# EAGLE design piano_pcb (EAGLE 9.3.1)
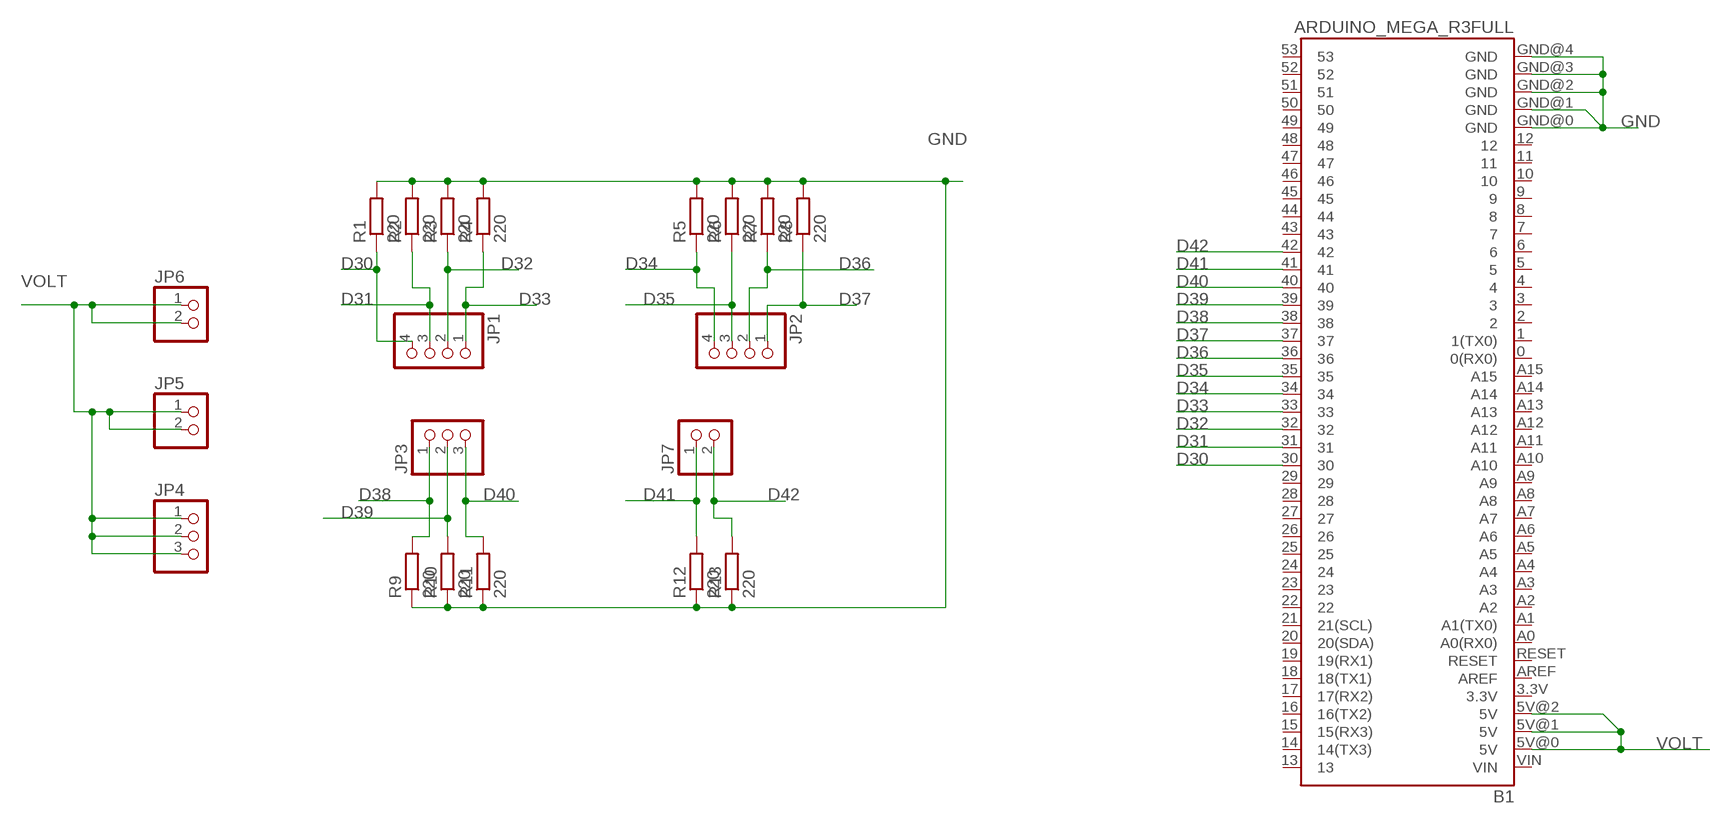
[diagram p0: schematic, sheet 1]

## Parts
B1  ARDUINO_MEGA_R3FULL  [ARDUINO_MEGA]
JP1  PINHD-1X4  [1X04]
JP2  PINHD-1X4  [1X04]
JP3  PINHD-1X3  [1X03]
JP4  PINHD-1X3  [1X03]
JP5  PINHD-1X2  [1X02]
JP6  PINHD-1X2  [1X02]
JP7  PINHD-1X2  [1X02]
R1  220  R-EU_0204/5  [0204/5]
R2  220  R-EU_0204/5  [0204/5]
R3  220  R-EU_0204/5  [0204/5]
R4  220  R-EU_0204/5  [0204/5]
R5  220  R-EU_0204/5  [0204/5]
R6  220  R-EU_0204/5  [0204/5]
R7  220  R-EU_0204/5  [0204/5]
R8  220  R-EU_0204/5  [0204/5]
R9  220  R-EU_0204/5  [0204/5]
R10  220  R-EU_0204/5  [0204/5]
R11  220  R-EU_0204/5  [0204/5]
R12  220  R-EU_0204/5  [0204/5]
R13  220  R-EU_0204/5  [0204/5]

## Nets
D30: B1.30 JP1.4 R1.1
D31: B1.31 JP1.3 R2.1
D32: B1.32 JP1.2 R3.1
D33: B1.33 JP1.1 R4.1
D34: B1.34 JP2.4 R5.1
D35: B1.35 JP2.3 R6.1
D36: B1.36 JP2.2 R7.1
D37: B1.37 JP2.1 R8.1
D38: B1.38 JP3.1 R9.2
D39: B1.39 JP3.2 R10.2
D40: B1.40 JP3.3 R11.2
D41: B1.41 JP7.1 R12.2
D42: B1.42 JP7.2 R13.2
GND: B1.GND@0(GND) B1.GND@1(GND) B1.GND@2(GND) B1.GND@3(GND) B1.GND@4(GND) R1.2 R2.2 R3.2 R4.2 R5.2 R6.2 R7.2 R8.2 R9.1 R10.1 R11.1 R12.1 R13.1
VOLT: B1.5V@0(5V) B1.5V@1(5V) B1.5V@2(5V) JP4.1 JP4.2 JP4.3 JP5.1 JP5.2 JP6.1 JP6.2
Unconnected: B1.0(0(RX0)) B1.1(1(TX0)) B1.2 B1.3 B1.3.3V B1.4 B1.5 B1.6 B1.7 B1.8 B1.9 B1.10 B1.11 B1.12 B1.13 B1.14(14(TX3)) B1.15(15(RX3)) B1.16(16(TX2)) B1.17(17(RX2)) B1.18(18(TX1)) B1.19(19(RX1)) B1.20(20(SDA)) B1.21(21(SCL)) B1.22 B1.23 B1.24 B1.25 B1.26 B1.27 B1.28 B1.29 B1.43 B1.44 B1.45 B1.46 B1.47 B1.48 B1.49 B1.50 B1.51 B1.52 B1.53 B1.A0(A0(RX0)) B1.A1(A1(TX0)) B1.A2 B1.A3 B1.A4 B1.A5 B1.A6 B1.A7 B1.A8 B1.A9 B1.A10 B1.A11 B1.A12 B1.A13 B1.A14 B1.A15 B1.AREF B1.RESET B1.VIN

## Library data of the parts
B1 = SparkFun-Boards:ARDUINO_MEGA_R3: Arduino Mega R3 ATmega2560 R3 compatible footprint. SparkFun Products: Arduino Mega 2560 R3 <https://www.sparkfun.com/products/11061>
JP1 JP2 = pinhead:PINHD-1X4: PIN HEADER
JP3 JP4 = pinhead:PINHD-1X3: PIN HEADER
JP5-JP7 = pinhead:PINHD-1X2: PIN HEADER
R1-R13 = rcl:R-EU_: RESISTOR, European symbol; SPICEPREFIX: R

## Board
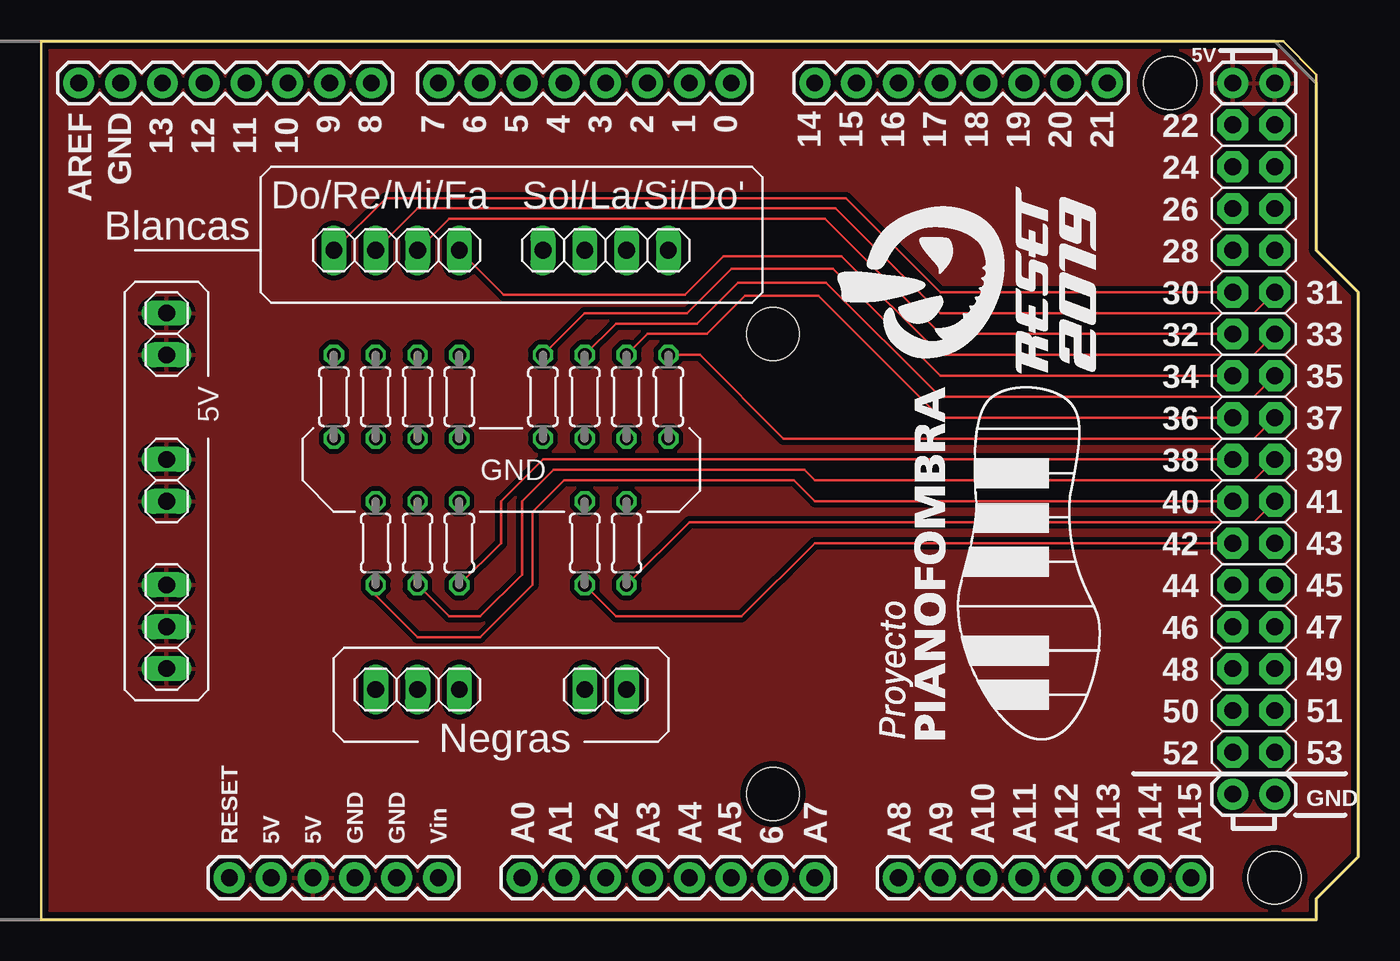
[diagram p1: board, top side]
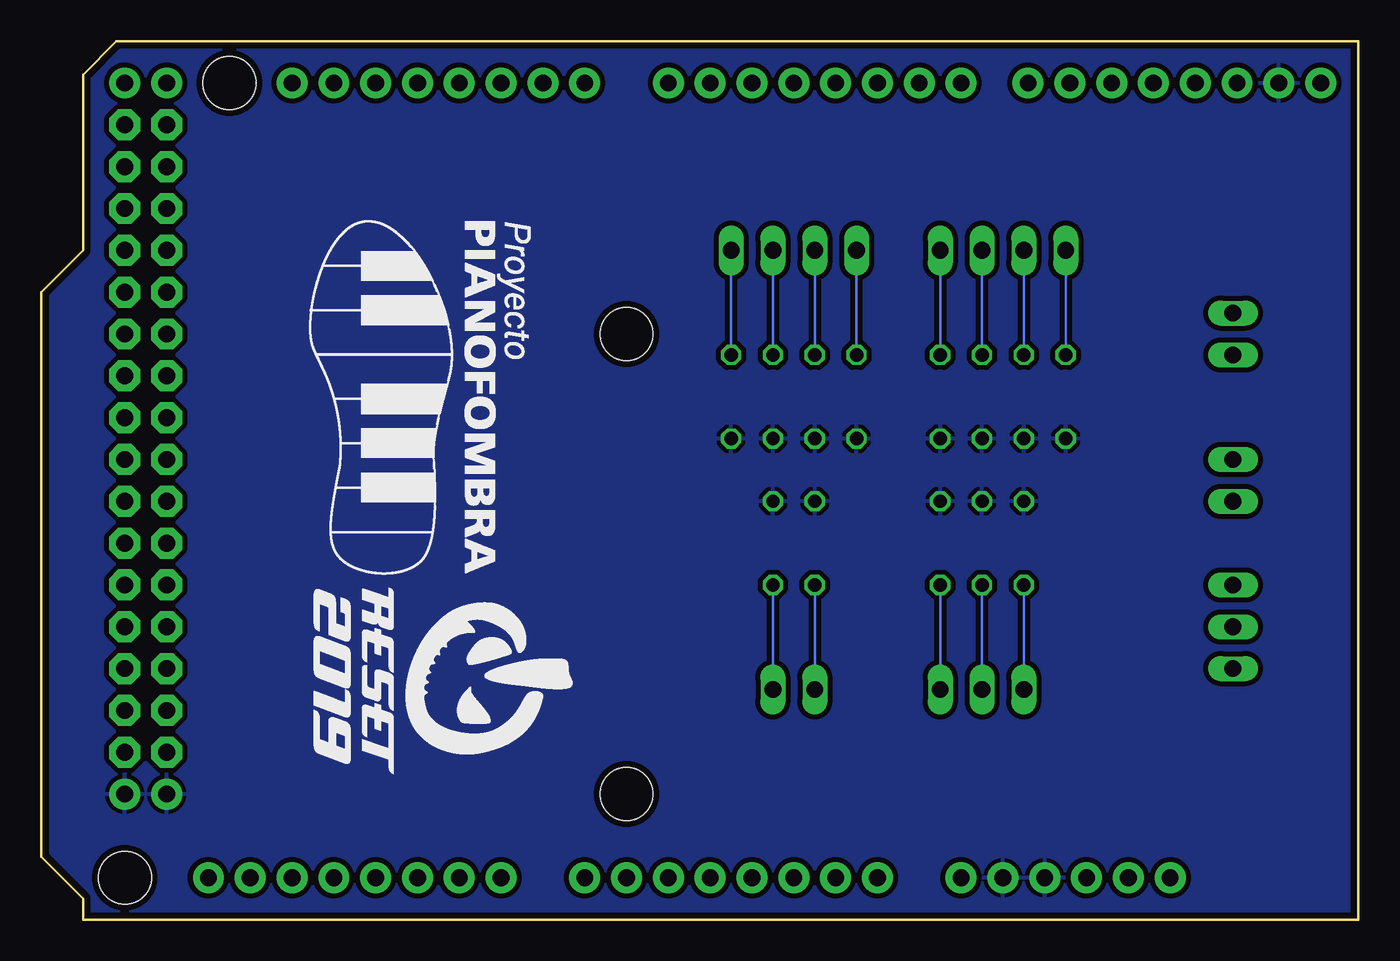
[diagram p2: board, bottom side, seen from below]

Size 80.01 x 53.34 mm. Coordinates in mm from the lower left corner, seen from the top.
Outline: 0,53.34 75.44,53.34 77.47,51.31 77.47,40.64 80.01,38.1 80.01,3.81 77.47,1.27 77.47,0 0,0 0,53.34
Copper layers (1*16): Top 0.035559375mm / dielectric 1.6mm / Bottom 0.035559375mm
Design rules "oshpark-2layer": minimum track width 6mil, minimum drill 10mil, track to track 6mil, track to pad 6mil, pad to pad 6mil, via to via 6mil, smd to smd 6mil, copper to edge 15mil, drill to drill 6mil, minimum pad ring 5mil, minimum via ring 5mil, stop-mask expansion 2.5mil, vias tented up to drill 0mil, thermal gap 10mil

### Footprints (pad centres in the part's own frame; a part is rotated, then mirrored left to right if it is on the bottom)
ARDUINO_MEGA = drill 1.016 pad 1.88: 0 13.97,24.13; 1 11.43,24.13; 2 8.89,24.13; 3 6.35,24.13; 3.3V -13.97,-24.13; 4 3.81,24.13; 5 1.27,24.13; 5V@0 -11.43,-24.13; 5V@1 44.45,24.13; 5V@2 46.99,24.13; 6 -1.27,24.13; 7 -3.81,24.13; 8 -7.874,24.13; 9 -10.414,24.13; 10 -12.954,24.13; 11 -15.494,24.13; 12 -18.034,24.13; 13 -20.574,24.13; 14 19.05,24.13; 15 21.59,24.13; 16 24.13,24.13; 17 26.67,24.13; 18 29.21,24.13; 19 31.75,24.13; 20 34.29,24.13; 21 36.83,24.13; A0 1.27,-24.13; A1 3.81,-24.13; A2 6.35,-24.13; A3 8.89,-24.13; A4 11.43,-24.13; A5 13.97,-24.13; A6 16.51,-24.13; A7 19.05,-24.13; A8 24.13,-24.13; A9 26.67,-24.13; A10 29.21,-24.13; A11 31.75,-24.13; A12 34.29,-24.13; A13 36.83,-24.13; A14 39.37,-24.13; A15 41.91,-24.13; AREF -25.654,24.13; GND@0 -8.89,-24.13; GND@1 -6.35,-24.13; GND@2 44.45,-19.05; GND@3 46.99,-19.05; GND@4 -23.114,24.13; RESET -16.51,-24.13; VIN -3.81,-24.13 | drill 1.016 pad 1.88 octagon: 22 44.45,21.59; 23 46.99,21.59; 24 44.45,19.05; 25 46.99,19.05; 26 44.45,16.51; 27 46.99,16.51; 28 44.45,13.97; 29 46.99,13.97; 30 44.45,11.43; 31 46.99,11.43; 32 44.45,8.89; 33 46.99,8.89; 34 44.45,6.35; 35 46.99,6.35; 36 44.45,3.81; 37 46.99,3.81; 38 44.45,1.27; 39 46.99,1.27; 40 44.45,-1.27; 41 46.99,-1.27; 42 44.45,-3.81; 43 46.99,-3.81; 44 44.45,-6.35; 45 46.99,-6.35; 46 44.45,-8.89; 47 46.99,-8.89; 48 44.45,-11.43; 49 46.99,-11.43; 50 44.45,-13.97; 51 46.99,-13.97; 52 44.45,-16.51; 53 46.99,-16.51 | hole 3.2: 16.51,8.89; 16.51,-19.05; 40.64,24.13; 46.99,-24.13
1X04 = drill 1.016 long: 1 -3.81,0; 2 -1.27,0; 3 1.27,0; 4 3.81,0
1X03 = drill 1.016 long: 1 -2.54,0; 2 0,0; 3 2.54,0
1X02 = drill 1.016 long: 1 -1.27,0; 2 1.27,0
0204/5 = drill 0.813 octagon: 1 -2.54,0; 2 2.54,0

### Placement (x,y rotation side)
B1  27.94,26.67 0 top
JP1  21.59,40.64 180 top
JP2  34.29,40.64 180 top
JP3  22.86,13.97 180 top
JP4  7.62,17.78 90 top
JP5  7.62,26.67 90 top
JP6  7.62,35.56 90 top
JP7  34.29,13.97 180 top
R1  17.78,31.75 270 top
R2  20.32,31.75 270 top
R3  22.86,31.75 270 top
R4  25.4,31.75 270 top
R5  30.48,31.75 270 top
R6  33.02,31.75 270 top
R7  35.56,31.75 270 top
R8  38.1,31.75 270 top
R9  25.4,22.86 270 top
R10  22.86,22.86 270 top
R11  20.32,22.86 270 top
R12  35.56,22.86 270 top
R13  33.02,22.86 270 top
U$1  [Z_LOGO_PIANO]  65.41,10.16 90 top
U$2  [Z_LOGO_PIANO]  64.77,43.18 270 bottom

### Tracks (layer width: path | path; a pad name or v marks a point on that pad's centre or on a via)
D30
  Top 0.152: JP1.4 20.95,43.81 48.9,43.81 54.61,38.1 B1.30
  Bottom 0.152: JP1.4 R1.1
D31
  Top 0.152: JP1.3 22.86,43.18 48.26,43.18 54.61,36.83 73.66,36.83 B1.31
  Bottom 0.152: JP1.3 R2.1
D32
  Top 0.152: JP1.2 24.77,42.55 47.62,42.55 54.61,35.56 B1.32
  Bottom 0.152: JP1.2 R3.1
D33
  Top 0.152: JP1.1 28.09,37.95 39.12,37.95 41.45,40.28 48.62,40.28 54.61,34.29 73.66,34.29 B1.33
  Bottom 0.152: JP1.1 R4.1
D34
  Top 0.152: R5.1 33.02,36.83 39.24,36.83 41.94,39.52 48.11,39.52 54.61,33.02 B1.34
  Bottom 0.152: JP2.4 R5.1
D35
  Top 0.152: R6.1 34.92,36.2 39.83,36.2 42.32,38.68 47.68,38.68 54.61,31.75 73.66,31.75 B1.35
  Bottom 0.152: JP2.3 R6.1
D36
  Top 0.152: R7.1 36.83,35.56 40.44,35.56 42.75,37.87 47.22,37.87 54.61,30.48 B1.36
  Bottom 0.152: JP2.2 R7.1
D37
  Top 0.152: B1.37 73.66,29.21 45.09,29.21 40.01,34.29 R8.1
  Bottom 0.152: JP2.1 R8.1
D38
  Top 0.152: R9.2 27.94,22.86 27.94,25.4 30.48,27.94 B1.38
  Bottom 0.152: R9.2 JP3.1
D39
  Top 0.152: R10.2 24.77,18.41 26.67,18.41 29.21,20.95 29.21,25.4 31.11,27.3 46.35,27.3 46.99,26.67 73.66,26.67 B1.39
  Bottom 0.152: R10.2 JP3.2
D40
  Top 0.152: R11.2 20.32,19.68 22.86,17.14 26.67,17.14 29.84,20.32 29.84,24.77 31.75,26.67 45.72,26.67 46.99,25.4 B1.40
  Bottom 0.152: R11.2 JP3.3
D41
  Top 0.152: R12.2 39.37,24.13 73.66,24.13 B1.41
  Bottom 0.152: R12.2 JP7.1
D42
  Top 0.152: B1.42 46.99,22.86 42.55,18.41 34.92,18.41 R13.2
  Bottom 0.152: R13.2 JP7.2
GND
  pour Bottom (isolate 0.305): -2.54,55.24 77.47,55.24 80.64,52.07 82.55,50.16 82.55,-0.64 79.38,-3.81 -0.64,-3.81 -2.54,-1.91
VOLT
  pour Top (isolate 0.305): -2.54,56.52 78.11,56.52 84.45,50.16 84.45,2.54 78.74,-3.17 -1.27,-3.17 -1.91,-2.54 -2.54,-1.91

### Text on the board
tPlace: Do/Re/Mi/Fa | Sol/La/Si/Do' | Blancas | 5V | GND | Negras